# Altium schematic sheet GatewayModbus.SchDoc: Gateway Modbus
size A4; Author: Tobias Bavasso Piizzi; CompanyName: Universidad Tecnológica Nacional; Revision: R00; SheetNumber: 1; SheetTotal: 1
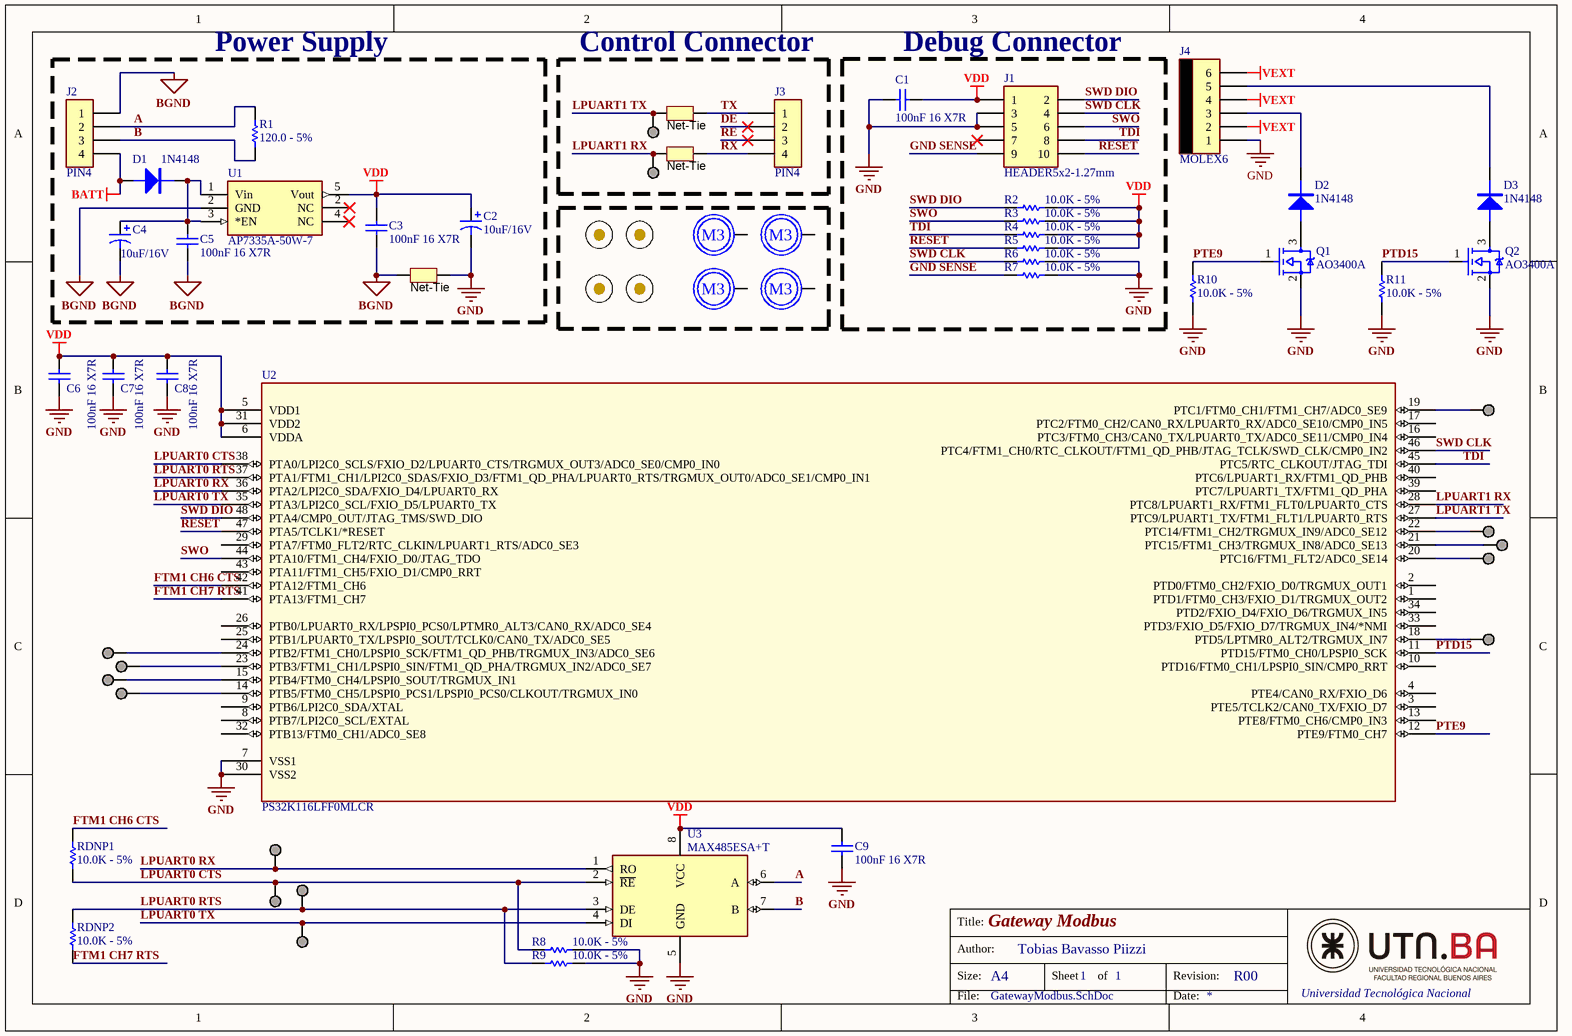
[diagram p0: GatewayModbus.SchDoc]

## Parts
C1  100nF 16 X7R  [CAPC0603]
C2  10uF/16V  [CAP POL TANT 1206]
C3  100nF 16 X7R  [CAPC0603]
C4  10uF/16V  [CAP POL TANT 1206]
C5  100nF 16 X7R  [CAPC0603]
C6  100nF 16 X7R  [CAPC0603]
C7  100nF 16 X7R  [CAPC0603]
C8  100nF 16 X7R  [CAPC0603]
C9  100nF 16 X7R  [CAPC0603]
D1  1N4148  [SOD323]
D2  1N4148  [SOD323]
D3  1N4148  [SOD323]
FID1  Fiducial  [Fiducial10-20]  (value not drawn)  (no BOM)
FID2  Fiducial  [Fiducial10-20]  (value not drawn)  (no BOM)
FID3  Fiducial  [Fiducial10-20]  (value not drawn)  (no BOM)
FID4  Fiducial  [Fiducial10-20]  (value not drawn)  (no BOM)
J1  HEADER5x2-1.27mm  [PAD10-2X05-HH]
J2  PIN4  [SIP4]
J3  PIN4  [SIP4]
J4  MOLEX6  [MOLEX6]
MH1  M3 Mount Hole  [M3_MOUNTING_HOLE]  (value not drawn)  (no BOM)
MH2  M3 Mount Hole  [M3_MOUNTING_HOLE]  (value not drawn)  (no BOM)
MH3  M3 Mount Hole  [M3_MOUNTING_HOLE]  (value not drawn)  (no BOM)
MH4  M3 Mount Hole  [M3_MOUNTING_HOLE]  (value not drawn)  (no BOM)
NT1  Net-Tie  [Net-Tie_50milWide_30milLong]  (net tie, no BOM)
NT2  Net-Tie  [Net-Tie_50milWide_30milLong]  (net tie, no BOM)
NT3  Net-Tie  [Net-Tie_50milWide_30milLong]  (net tie, no BOM)
Q1  AO3400A  [SOT-23]
Q2  AO3400A  [SOT-23]
R1  120.0 - 5%  [RESC0603]
R2  10.0K - 5%  [RESC0603]
R3  10.0K - 5%  [RESC0603]
R4  10.0K - 5%  [RESC0603]
R5  10.0K - 5%  [RESC0603]
R6  10.0K - 5%  [RESC0603]
R7  10.0K - 5%  [RESC0603]
R8  10.0K - 5%  [RESC0603]
R9  10.0K - 5%  [RESC0603]
R10  10.0K - 5%  [RESC0603]
R11  10.0K - 5%  [RESC0603]
RDNP1  10.0K - 5%  [RESC0603]
RDNP2  10.0K - 5%  [RESC0603]
TP1  (no value)  [TP_SMD_Ø1.0mm]  (no BOM)
TP2  (no value)  [TP_SMD_Ø1.0mm]  (no BOM)
TP3  (no value)  [TP_SMD_Ø0.6mm]  (no BOM)
TP4  (no value)  [TP_SMD_Ø0.6mm]  (no BOM)
TP5  (no value)  [TP_SMD_Ø0.6mm]  (no BOM)
TP6  (no value)  [TP_SMD_Ø0.6mm]  (no BOM)
TP7  (no value)  [TP_SMD_Ø0.6mm]  (no BOM)
TP8  (no value)  [TP_SMD_Ø0.6mm]  (no BOM)
TP9  (no value)  [TP_SMD_Ø0.6mm]  (no BOM)
TP10  (no value)  [TP_SMD_Ø0.6mm]  (no BOM)
TP11  (no value)  [TP_SMD_Ø0.6mm]  (no BOM)
TP12  (no value)  [TP_SMD_Ø1.0mm]  (no BOM)
TP13  (no value)  [TP_SMD_Ø1.0mm]  (no BOM)
TP14  (no value)  [TP_SMD_Ø1.0mm]  (no BOM)
TP15  (no value)  [TP_SMD_Ø1.0mm]  (no BOM)
U1  AP7335A-50W-7  [SOT-23-5]
U2  PS32K116LFF0MLCR  [LQFP48-NXP]
U3  MAX485ESA+T  [SOIC8]

## Blocks framed on the sheet
Power Supply: C2-C5 D1 J2 NT3 R1 U1
Control Connector: J3 NT1 NT2 TP1 TP2
Debug Connector: C1 J1 R2-R7

## Nets
BATT: D1.A J2.4
BGND: C3.1 C4.2 C5.1 J2.1 NT3.1 U1.2(GND)
GND: C1.1 C2.2 C6.1 C7.1 C8.1 C9.2 J1.3 J1.5 J4.1 NT3.2 Q1.2(S) Q2.2(S) R6.1 R7.1 R8.1 R9.1 R10.2 R11.2 U2.7(VSS1) U2.30(VSS2) U3.5(GND)
VDD: C1.2 C2.1 C3.2 C6.2 C7.2 C8.2 C9.1 J1.1 R2.1 R3.1 R4.1 R5.1 U1.5(Vout) U2.5(VDD1) U2.6(VDDA) U2.31(VDD2) U3.8(VCC)
VEXT: J4.2 J4.4 J4.6
A: J2.2 R1.1 U3.6(A)
B: J2.3 R1.2 U3.7(B)
DE: J3.2
FTM1 CH6 CTS: RDNP1.1 U2.42(PTA12/FTM1_CH6)
FTM1 CH7 RTS: RDNP2.2 U2.41(PTA13/FTM1_CH7)
GND SENSE: J1.9 R7.2
LPUART0 CTS: R8.2 RDNP1.2 TP14.1 U2.38(PTA0/LPI2C0_SCLS/FXIO_D2/LPUART0_CTS/TRGMUX_OUT3/ADC0_SE0/CMP0_IN0) U3.2(~{RE})
LPUART0 RTS: R9.2 RDNP2.1 TP13.1 U2.37(PTA1/FTM1_CH1/LPI2C0_SDAS/FXIO_D3/FTM1_QD_PHA/LPUART0_RTS/TRGMUX_OUT0/ADC0_SE1/CMP0_IN1) U3.3(DE)
LPUART0 RX: TP12.1 U2.36(PTA2/LPI2C0_SDA/FXIO_D4/LPUART0_RX) U3.1(RO)
LPUART0 TX: TP15.1 U2.35(PTA3/LPI2C0_SCL/FXIO_D5/LPUART0_TX) U3.4(DI)
LPUART1 RX: NT2.1 TP2.1 U2.28(PTC8/LPUART1_RX/FTM1_FLT0/LPUART0_CTS)
LPUART1 TX: NT1.1 TP1.1 U2.27(PTC9/LPUART1_TX/FTM1_FLT1/LPUART0_RTS)
PTD15: Q2.1(G) R11.1 U2.11(PTD15/FTM0_CH0/LPSPI0_SCK)
PTE9: Q1.1(G) R10.1 U2.12(PTE9/FTM0_CH7)
~{RESET}: J1.10 R5.2 U2.47(PTA5/TCLK1/*RESET)
RE: J3.3
RX: J3.4 NT2.2
SWD CLK: J1.4 R6.2 U2.46(PTC4/FTM1_CH0/RTC_CLKOUT/FTM1_QD_PHB/JTAG_TCLK/SWD_CLK/CMP0_IN2)
SWD DIO: J1.2 R2.2 U2.48(PTA4/CMP0_OUT/JTAG_TMS/SWD_DIO)
SWO: J1.6 R3.2 U2.44(PTA10/FTM1_CH4/FXIO_D0/JTAG_TDO)
TDI: J1.8 R4.2 U2.45(PTC5/RTC_CLKOUT/JTAG_TDI)
TX: J3.1 NT1.2
NetC4_1: C4.1 C5.2 D1.K U1.1(Vin) U1.3(*EN)
NetD2_A: D2.A Q1.3(D)
NetD2_K: D2.K J4.3
NetD3_A: D3.A Q2.3(D)
NetD3_K: D3.K J4.5
NetTP3_1: TP3.1 U2.22(PTC14/FTM1_CH2/TRGMUX_IN9/ADC0_SE12)
NetTP4_1: TP4.1 U2.21(PTC15/FTM1_CH3/TRGMUX_IN8/ADC0_SE13)
NetTP5_1: TP5.1 U2.24(PTB2/FTM1_CH0/LPSPI0_SCK/FTM1_QD_PHB/TRGMUX_IN3/ADC0_SE6)
NetTP6_1: TP6.1 U2.23(PTB3/FTM1_CH1/LPSPI0_SIN/FTM1_QD_PHA/TRGMUX_IN2/ADC0_SE7)
NetTP7_1: TP7.1 U2.15(PTB4/FTM0_CH4/LPSPI0_SOUT/TRGMUX_IN1)
NetTP8_1: TP8.1 U2.14(PTB5/FTM0_CH5/LPSPI0_PCS1/LPSPI0_PCS0/CLKOUT/TRGMUX_IN0)
NetTP9_1: TP9.1 U2.19(PTC1/FTM0_CH1/FTM1_CH7/ADC0_SE9)
NetTP10_1: TP10.1 U2.18(PTD5/LPTMR0_ALT2/TRGMUX_IN7)
NetTP11_1: TP11.1 U2.20(PTC16/FTM1_FLT2/ADC0_SE14)

Not connected (* = marked no-connect by the designer): J1 7*; MH1 1(TP); MH2 1(TP); MH3 1(TP); MH4 1(TP); U1 4(NC)*; U2 1(PTD1/FTM0_CH3/FXIO_D1/TRGMUX_OUT2) 2(PTD0/FTM0_CH2/FXIO_D0/TRGMUX_OUT1) 3(PTE5/TCLK2/CAN0_TX/FXIO_D7) 4(PTE4/CAN0_RX/FXIO_D6) 8(PTB7/LPI2C0_SCL/EXTAL) 9(PTB6/LPI2C0_SDA/XTAL) 10(PTD16/FTM0_CH1/LPSPI0_SIN/CMP0_RRT) 13(PTE8/FTM0_CH6/CMP0_IN3) 16(PTC3/FTM0_CH3/CAN0_TX/LPUART0_TX/ADC0_SE11/CMP0_IN4) 17(PTC2/FTM0_CH2/CAN0_RX/LPUART0_RX/ADC0_SE10/CMP0_IN5) 25(PTB1/LPUART0_TX/LPSPI0_SOUT/TCLK0/CAN0_TX/ADC0_SE5) 26(PTB0/LPUART0_RX/LPSPI0_PCS0/LPTMR0_ALT3/CAN0_RX/ADC0_SE4) 29(PTA7/FTM0_FLT2/RTC_CLKIN/LPUART1_RTS/ADC0_SE3) 32(PTB13/FTM0_CH1/ADC0_SE8) 33(PTD3/FXIO_D5/FXIO_D7/TRGMUX_IN4/*NMI) 34(PTD2/FXIO_D4/FXIO_D6/TRGMUX_IN5) 39(PTC7/LPUART1_TX/FTM1_QD_PHA) 40(PTC6/LPUART1_RX/FTM1_QD_PHB) 43(PTA11/FTM1_CH5/FXIO_D1/CMP0_RRT)

## Notes on the sheet
- Title:
- Size:
- Author:
- A4
- Sheet
- of
- Revision:
- File:
- Date:
- (in symbol M3 Mount Hole) M3

## Library data of the parts
C1 C3 C5-C9 = CAPC0603: SMD Ceramic Chip Capacitor 0603
C2 C4 = CAP POL TANT: Polarized Capacitor Tantalium
D1-D3 = 1N4148: Small Signal Diode
FID1-FID4 = Fiducial: Fiducial mark.  There is nothing to buy or mount.. No entry in BOM.; SymbolCreator: codlsc; SymbolVersion: 2009-11-4; CompType: Fiducial; Publisher: Texas Instruments; LatestRevisionDate: 2014-08-01; LatestRevisionNote: Added Alternate PartNumber and Alternate Manufacturer parameters to appropriate components.; Manufacturer: N/A; MountType: N/A; PackageReference: Fiducial; PartNumber: N/A; ClassName: FiducialMark
J1 = HEADER5x2-1.27mm: PAD10-2X05-HH
MH1-MH4 = M3 Mount Hole: M3 Mounting Hole
NT1-NT3 = Net-Tie: Single point connection between nets.; SymbolCreator: codlsc; SymbolVersion: 2009-07-01; MountType: SMT; PackageReference: N/A; Publisher: Texas Instruments; LatestRevisionDate: 2015-10-18; LatestRevisionNote: Added Alternate PartNumber and Alternate Manufacturer parameters to appropriate components.
Q1 Q2 = AO3400A: 30V 5.8A 35mΩ@10V,5.8A 1.4W 1.4V@250uA 1 N-Channel SOT-23 MOSFETs ROHS
R1-R11 RDNP1 RDNP2 = RESC 0603: SMD Chip Resistor 0603
TP1-TP15 = TESTPOINT: TEST POINT.  No entry in BOM.; SymbolVersion: 2010-10-20; PackageReference: N/A; CompType: Testpoint; Publisher: Texas Instruments; LatestRevisionDate: 2015-10-18; LatestRevisionNote: Added Alternate PartNumber and Alternate Manufacturer parameters to appropriate components.
U1 = AP7335A-50W-7: IC REG LINEAR 5V 300MA SOT25
U2 = PS32K116LFF0MLCR: Microcontroladores ARM - MCU S32K116, M0+, Flash 128K, RAM 17KB; Built_By: EMA_Jessica; Vendor: NXP; Copyright: Copyright (C) 2016 Accelerated Designs. All rights reserved; Manufacturer_Part_Number: ps32k116lff0mlcr; RefDes: RefDes; Type: Type; Value: Value
U3 = MAX485ESA+T: 1/1 Transceiver Half RS422, RS485 8-SOIC; MF: Maxim Integrated; MP: MAX485ESA; SnapEDA_Link: https://www.snapeda.com/parts/MAX485ESA/Maxim+Integrated/view-part/?ref=snap; Purchase-URL: https://pricing.snapeda.com/search/part/MAX485ESA/?ref=eda; Value: *; Package: SOIC-8 Maxim; Price: None; Availability: In Stock; Check_prices: https://www.snapeda.com/parts/MAX485ESA/Maxim+Integrated/view-part/?ref=eda